# Altium schematic sheet audio.SchDoc
size A4
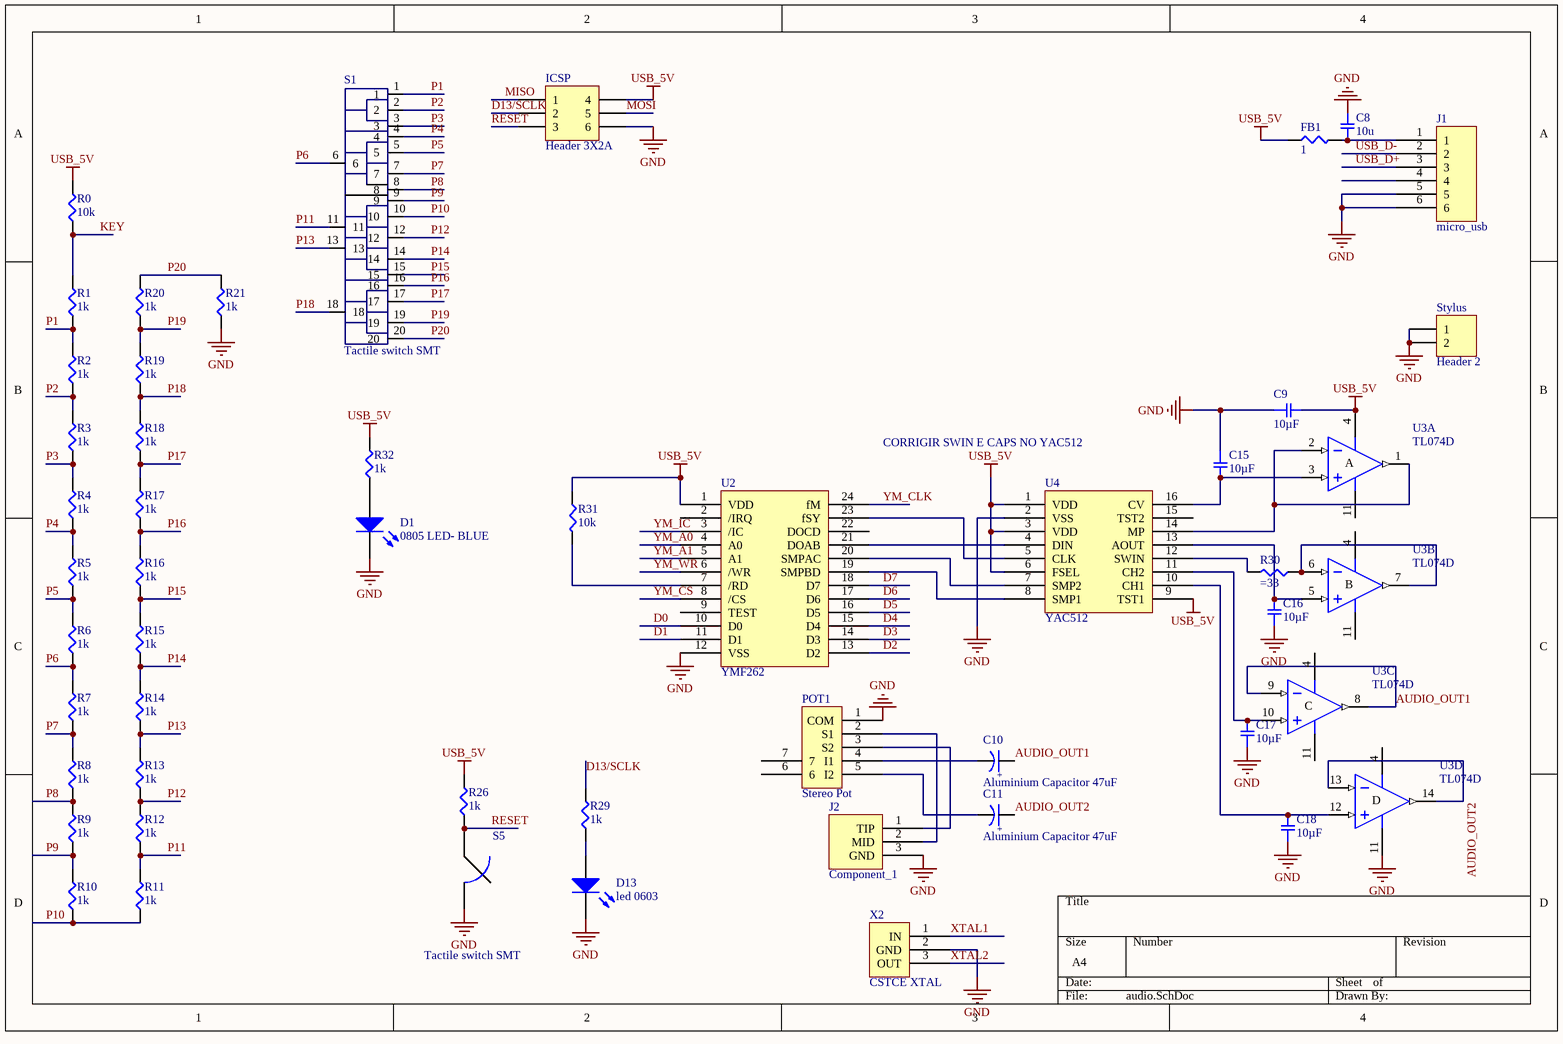
[diagram p0: audio.SchDoc]

## Parts
C8  10u  [SMD-0805C]
C9  10µF  [SMD-0805C]
C10  Aluminium Capacitor 47uF  [Aluminium Capacitor 47uF]
C11  Aluminium Capacitor 47uF  [Aluminium Capacitor 47uF]
C15  10µF  [SMD-0805C]
C16  10µF  [SMD-0805C]
C17  10µF  [SMD-0805C]
C18  10µF  [SMD-0805C]
D1  0805 LED- BLUE  [0805 LED]
D13  led 0603  [led 0603]
FB1  1  [SMD-0603-RES]
ICSP  Header 3X2A  [HDR2X3_CEN]
J1  micro_usb  [MICROUSB]
J2  Component_1  [PCBComponent_1]
POT1  Stereo Pot  [stereo_pot]
R0  10k  [SMD-0805-RES]
R1  1k  [SMD-0805-RES]
R2  1k  [SMD-0805-RES]
R3  1k  [SMD-0805-RES]
R4  1k  [SMD-0805-RES]
R5  1k  [SMD-0805-RES]
R6  1k  [SMD-0805-RES]
R7  1k  [SMD-0805-RES]
R8  1k  [SMD-0805-RES]
R9  1k  [SMD-0805-RES]
R10  1k  [SMD-0805-RES]
R11  1k  [SMD-0805-RES]
R12  1k  [SMD-0805-RES]
R13  1k  [SMD-0805-RES]
R14  1k  [SMD-0805-RES]
R15  1k  [SMD-0805-RES]
R16  1k  [SMD-0805-RES]
R17  1k  [SMD-0805-RES]
R18  1k  [SMD-0805-RES]
R19  1k  [SMD-0805-RES]
R20  1k  [SMD-0805-RES]
R21  1k  [SMD-0805-RES]
R26  1k  [SMD-0805-RES]
R29  1k  [SMD-0805-RES]
R30  (no value)  [SMD-0805-RES]
R31  10k  [SMD-0805-RES]
R32  1k  [SMD-0805-RES]
S1  Tactile switch SMT  [left_key]
S5  Tactile switch SMT  [Tactile switch SMT]
Stylus  Header 2  [HDR1X2]
U2  YMF262  [ymf262]
U3  TL074D  [D014_N]  (parts A,B,C,D of 4)
U4  YAC512  [YAC512-M]
X2  CSTCE XTAL  [CSTCE-CCM-R0]

## Nets
GND: C8.2 C9.1 C15.1 C16.1 C17.1 C18.1 D1.2(K) D13.2 ICSP.6 J1.5 J1.6 J2.3(GND) POT1.1(COM) R21.1 S5.2 Stylus.1 Stylus.2 U2.12(VSS) U3.11(V-) U4.2(VSS) X2.2(GND)
USB_5V: C9.2 FB1.1 ICSP.4 R0.2 R26.2 R31.1 R32.2 U2.1(VDD) U3.4(V+) U4.1(VDD) U4.3(VDD) U4.6(FSEL) U4.9(TST1)
AUDIO_OUT1: C10.1 U3.8(OUT) U3.9(IN-)
AUDIO_OUT2: C11.1 U3.13(IN-) U3.14(OUT)
D0: U2.10(D0)
D1: U2.11(D1)
D2: U2.13(D2)
D3: U2.14(D3)
D4: U2.15(D4)
D5: U2.16(D5)
D6: U2.17(D6)
D7: U2.18(D7)
D13/SCLK: ICSP.2 R29.2
KEY: R0.1 R1.2
MISO: ICSP.1
MOSI: ICSP.5
P1: R1.1 R2.2 S1.1
P2: R2.1 R3.2 S1.2
P3: R3.1 R4.2 S1.3
P4: R4.1 R5.2 S1.4
P5: R5.1 R6.2 S1.5
P6: R6.1 R7.2 S1.6
P7: R7.1 R8.2 S1.7
P8: R8.1 R9.2 S1.8
P9: R9.1 R10.2 S1.9
P10: R10.1 R11.1 S1.10
P11: R11.2 R12.1 S1.11
P12: R12.2 R13.1 S1.12
P13: R13.2 R14.1 S1.13
P14: R14.2 R15.1 S1.14
P15: R15.2 R16.1 S1.15
P16: R16.2 R17.1 S1.16
P17: R17.2 R18.1 S1.17
P18: R18.2 R19.1 S1.18
P19: R19.2 R20.1 S1.19
P20: R20.2 R21.2 S1.20
RESET: ICSP.3 R26.1 S5.1
USB_D+: J1.3
USB_D-: J1.2
XTAL1: X2.1(IN)
XTAL2: X2.3(OUT)
YM_A0: U2.4(A0)
YM_A1: U2.5(A1)
YM_CLK: U2.24(fM)
YM_CS: U2.8(/CS)
YM_IC: U2.3(/IC)
YM_WR: U2.6(/WR)
NetC8_1: C8.1 FB1.2 J1.1
NetC10_2: C10.2 POT1.4(I1)
NetC11_2: C11.2 POT1.5(I2)
NetC15_2: C15.2 U3.3(IN+) U4.16(CV)
NetC16_2: C16.2 U3.5(IN+) U4.13(AOUT)
NetC17_2: C17.2 U3.10(IN+) U4.11(CH2)
NetC18_2: C18.2 U3.12(IN+) U4.10(CH1)
NetD1_1: D1.1(A) R32.1
NetD13_1: D13.1 R29.1
NetJ2_1: J2.1(TIP) POT1.3(S2)
NetJ2_2: J2.2(MID) POT1.2(S1)
NetR30_1: R30.1 U3.6(IN-) U3.7(OUT)
NetR30_2: R30.2 U4.12(SWIN)
NetR31_2: R31.2 U2.7(/RD)
NetU2_19: U2.19(SMPBD) U4.8(SMP1)
NetU2_20: U2.20(SMPAC) U4.7(SMP2)
NetU2_21: U2.21(DOAB) U4.4(DIN)
NetU2_23: U2.23(fSY) U4.5(CLK)
NetU3_1: U3.1(OUT) U3.2(IN-) U4.14(MP)

Not connected (* = marked no-connect by the designer): J1 4; POT1 6 7; U2 2(/IRQ) 9(TEST) 22(DOCD); U4 15(TST2)

## Notes on the sheet
- CORRIGIR SWIN E CAPS NO YAC512
- (in symbol Aluminium Capacitor 47uF) +
- (in symbol TL074D, part A) A
- (in symbol TL074D, part B) B
- (in symbol TL074D, part C) C
- (in symbol TL074D, part D) D

## Library data of the parts
C8 = GRM216R71E103KA01D: CAP CER 10000PF 25V X7R 0805; Manufacturer: Murata Electronics North America; Factory Stock: 0; Unit Price (USD): 0.1; Minimum Quantity: 1; Tolerance: ±10%; Datasheets: http://www.murata.com/~/media/webrenewal/support/library/catalog/products/capacitor/mlcc/c02e.pdf; Image: //media.digikey.com/Renders/Murata%20Renders/0805%20(2012%20Metric)%20.85mm.jpg; Digi-Key Part Number: 490-12748-1-ND; Part Number: GRM216R71E103KA01D; Quantity Available: 9736; @ qty: 0; Packaging: Cut Tape (CT); Series: GRM; Part Status: Active; Value: 10000pF; Voltage: 25V; Temperature Coefficient: X7R; Operating Temperature: -55°C ~ 125°C; Features: -; Ratings: -; Applications: General Purpose; Mounting Type: Surface Mount, MLCC; Package / Case: 0805 (2012 Metric); Size / Dimension: 0.079" L x 0.049" W (2.00mm x 1.25mm); Height - Seated (Max): -; Thickness (Max): 0.028" (0.70mm); Lead Spacing: -; Lead Style: -
C9 C15-C18 = GRM219R60J106KE19D: CAP CER 10UF 6.3V X5R 0805; Manufacturer: Murata Electronics North America; Factory Stock: 0; Unit Price (USD): 0.13; Minimum Quantity: 1; Tolerance: ±10%; Datasheets: http://www.murata.com/~/media/webrenewal/support/library/catalog/products/capacitor/mlcc/c02e.pdf; Image: //media.digikey.com/Renders/Murata%20Renders/0805%20(2012%20Metric)%20.85mm.jpg; Digi-Key Part Number: 490-3340-1-ND; Part Number: GRM219R60J106KE19D; Quantity Available: 448313; @ qty: 0; Packaging: Cut Tape (CT); Series: GRM; Part Status: Active; Value: 10µF; Voltage: 6.3V; Temperature Coefficient: X5R; Operating Temperature: -55°C ~ 85°C; Features: -; Ratings: -; Applications: General Purpose; Mounting Type: Surface Mount, MLCC; Package / Case: 0805 (2012 Metric); Size / Dimension: 0.079" L x 0.049" W (2.00mm x 1.25mm); Height - Seated (Max): -; Thickness (Max): 0.037" (0.95mm); Lead Spacing: -; Lead Style: -
FB1 = ERJ-3BQF1R0V: RES SMD 1 OHM 1% 1/4W 0603; Manufacturer: Panasonic Electronic Components; Factory Stock: 0; Unit Price (USD): 0.05386; @ qty: 1500; Power (Watts): 0.25W, 1/4W; Temperature Coefficient: ±200ppm/°C; Part Number: ERJ-3BQF1R0V; Datasheets: https://industrial.panasonic.com/cdbs/www-data/pdf/RDA0000/AOA0000C239.pdf; Image: //media.digikey.com/Photos/Panasonic%20Photos/MFG_ERJ-P6W%20Series.jpg; Digi-Key Part Number: P17371CT-ND; Quantity Available: 30514; Minimum Quantity: 1; Packaging: Cut Tape (CT); Series: ERJ; Part Status: Active; Value: 1; Tolerance: ±1%; Composition: Thick Film; Features: Automotive AEC-Q200, Current Sense; Operating Temperature: -55°C ~ 125°C; Package / Case: 0603 (1608 Metric); Supplier Device Package: 0603; Size / Dimension: 0.063" L x 0.031" W (1.60mm x 0.80mm); Height - Seated (Max): 0.022" (0.55mm); Number of Terminations: 2; Failure Rate: -
ICSP = Header 3X2A: Header, 3-Pin, Dual row; LatestRevisionDate: 17-Jul-2002; LatestRevisionNote: Re-released for DXP Platform.; Publisher: Altium Limited
J1 = micro_usb: micro USB Type B
POT1 = Stereo Pot: Stereo Audio Pot
R0-R21 R26 R29-R32 = ERJ-P06F1001V: RES SMD 1K OHM 1% 1/2W 0805; Manufacturer: Panasonic Electronic Components; Factory Stock: 0; Unit Price (USD): 0.02534; @ qty: 1500; Minimum Quantity: 1; Power (Watts): 0.5W, 1/2W; Temperature Coefficient: ±100ppm/°C; Part Number: ERJ-P06F1001V; Datasheets: https://industrial.panasonic.com/cdbs/www-data/pdf/RDA0000/AOA0000C243.pdf; Image: //media.digikey.com/Renders/Panasonic%20Renders/ERJ-0805%20Pkg.jpg; Digi-Key Part Number: P16058CT-ND; Quantity Available: 161264; Packaging: Cut Tape (CT); Series: ERJ; Part Status: Active; Value: 1k; Tolerance: ±1%; Composition: Thick Film; Features: Automotive AEC-Q200, Pulse Withstanding; Operating Temperature: -55°C ~ 155°C; Package / Case: 0805 (2012 Metric); Supplier Device Package: 0805; Size / Dimension: 0.079" L x 0.049" W (2.00mm x 1.25mm); Height - Seated (Max): 0.028" (0.70mm); Number of Terminations: 2; Failure Rate: -
Stylus = Header 2: Header, 2-Pin; LatestRevisionDate: 17-Jul-2002; LatestRevisionNote: Re-released for DXP Platform.; Publisher: Altium Limited
U2 = YMF262: YAMAHA OPL3 YMF262 FM SYNTHESIS
U3 = TL074D: Low-Noise JFET-Input Operational Amplifier; Published: 16-Jan-2001; LatestRevisionDate: 13-Apr-2006; LatestRevisionNote: IPC-7351 Footprint Added.; DatasheetVersion: Aug-1996; PackageVersion: Jan-1998; PackageReference: D014; Publisher: Altium Limited; PackageDescription: 14-Pin Small Outline Integrated Circuit 1.27 mm Pitch; Code_IPC: SOIC127P600-14; ComponentLink1Description: Manufacturer Link; ComponentLink1URL: http://www.ti.com/; ComponentLink2Description: Datasheet; ComponentLink2URL: http://www-s.ti.com/sc/ds/tl074.pdf
X2 = CSTCE XTAL: CST XTAL